# EAGLE schematic flex_led_wrap (EAGLE 6.6.0)
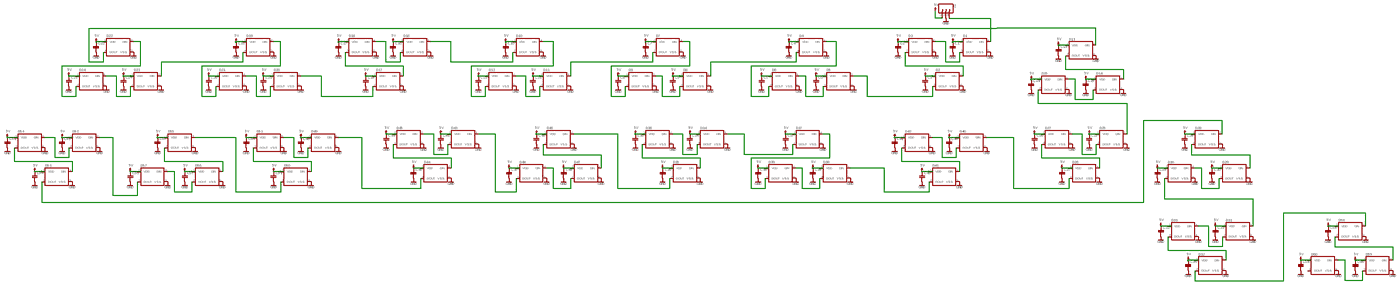
[diagram p0: schematic, sheet 1, overview]
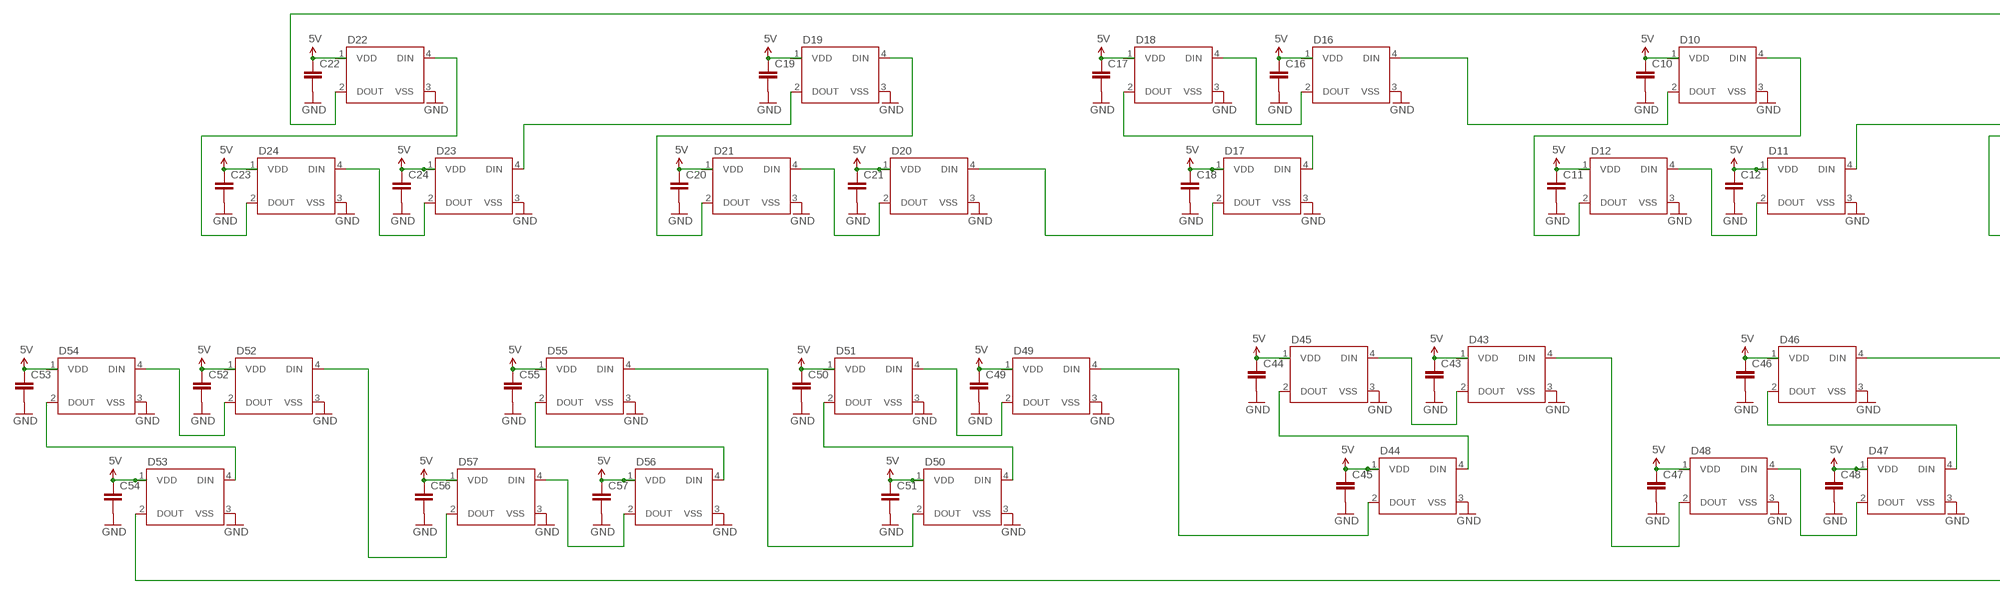
[diagram p1: schematic, sheet 1, part 1 of 4]
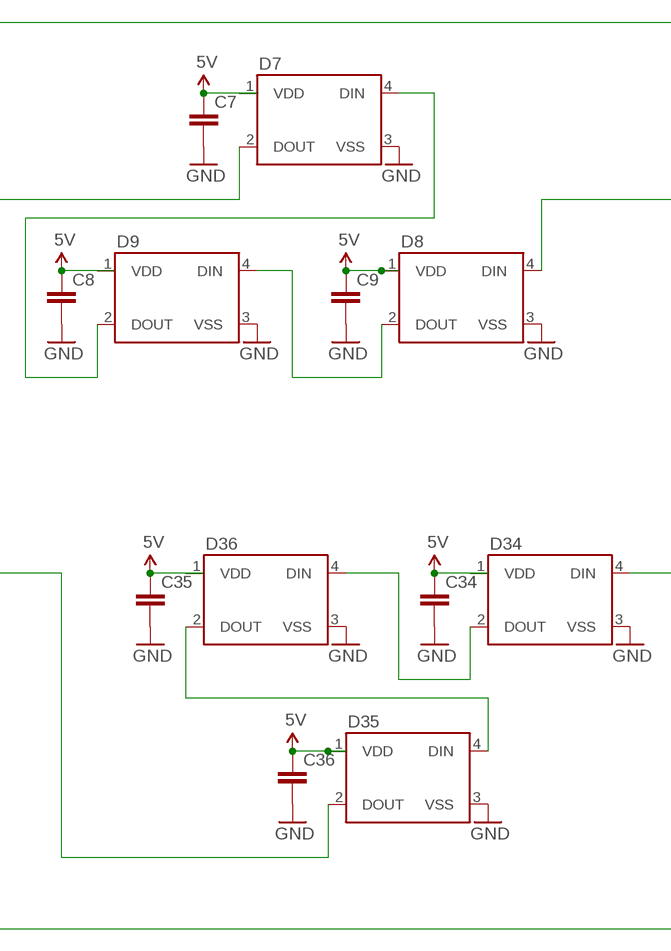
[diagram p2: schematic, sheet 1, part 2 of 4]
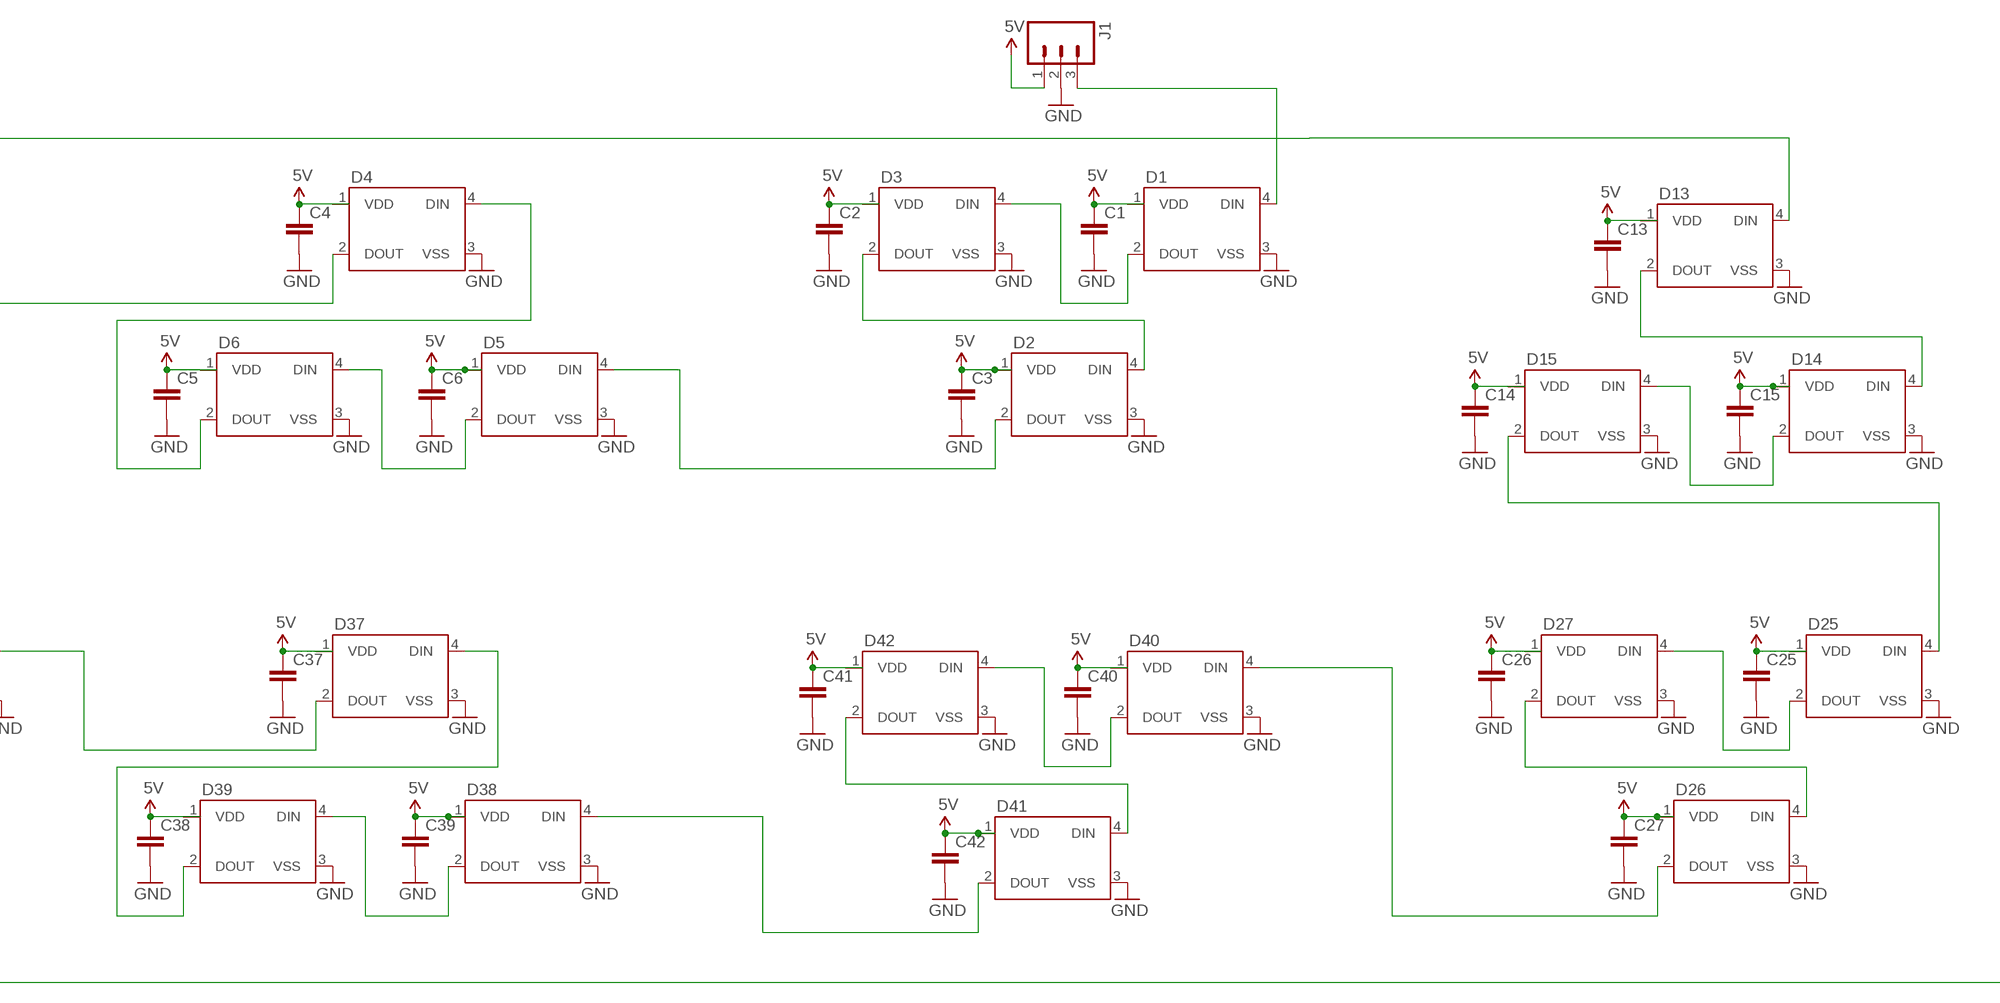
[diagram p3: schematic, sheet 1, part 3 of 4]
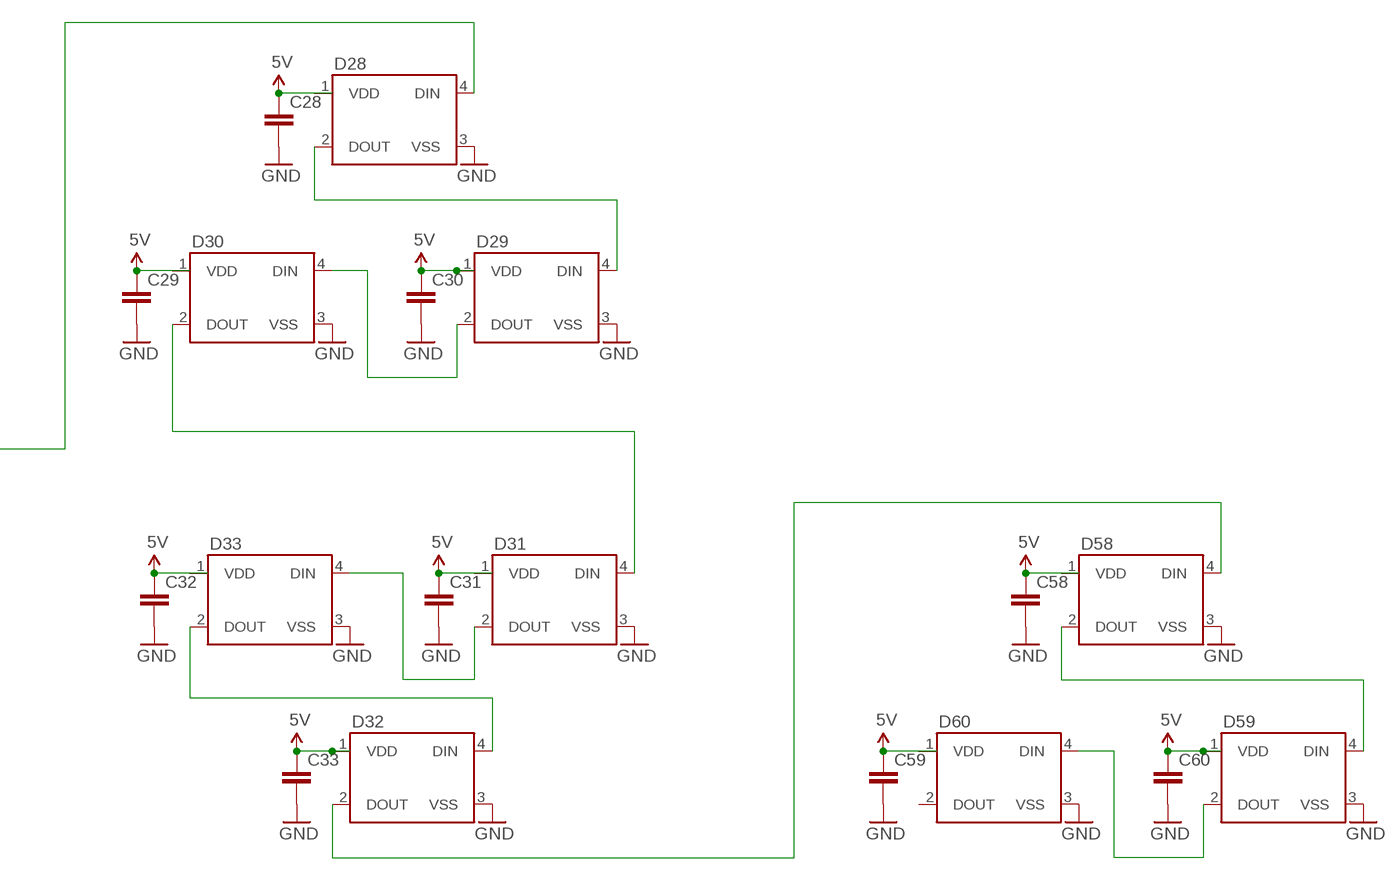
[diagram p4: schematic, sheet 1, part 4 of 4]

## Parts
C1  CAP0805  [0805]
C2  CAP0805  [0805]
C3  CAP0805  [0805]
C4  CAP0805  [0805]
C5  CAP0805  [0805]
C6  CAP0805  [0805]
C7  CAP0805  [0805]
C8  CAP0805  [0805]
C9  CAP0805  [0805]
C10  CAP0805  [0805]
C11  CAP0805  [0805]
C12  CAP0805  [0805]
C13  CAP0805  [0805]
C14  CAP0805  [0805]
C15  CAP0805  [0805]
C16  CAP0805  [0805]
C17  CAP0805  [0805]
C18  CAP0805  [0805]
C19  CAP0805  [0805]
C20  CAP0805  [0805]
C21  CAP0805  [0805]
C22  CAP0805  [0805]
C23  CAP0805  [0805]
C24  CAP0805  [0805]
C25  CAP0805  [0805]
C26  CAP0805  [0805]
C27  CAP0805  [0805]
C28  CAP0805  [0805]
C29  CAP0805  [0805]
C30  CAP0805  [0805]
C31  CAP0805  [0805]
C32  CAP0805  [0805]
C33  CAP0805  [0805]
C34  CAP0805  [0805]
C35  CAP0805  [0805]
C36  CAP0805  [0805]
C37  CAP0805  [0805]
C38  CAP0805  [0805]
C39  CAP0805  [0805]
C40  CAP0805  [0805]
C41  CAP0805  [0805]
C42  CAP0805  [0805]
C43  CAP0805  [0805]
C44  CAP0805  [0805]
C45  CAP0805  [0805]
C46  CAP0805  [0805]
C47  CAP0805  [0805]
C48  CAP0805  [0805]
C49  CAP0805  [0805]
C50  CAP0805  [0805]
C51  CAP0805  [0805]
C52  CAP0805  [0805]
C53  CAP0805  [0805]
C54  CAP0805  [0805]
C55  CAP0805  [0805]
C56  CAP0805  [0805]
C57  CAP0805  [0805]
C58  CAP0805  [0805]
C59  CAP0805  [0805]
C60  CAP0805  [0805]
D1  WS2812B  [WS2812B]
D2  WS2812B  [WS2812B]
D3  WS2812B  [WS2812B]
D4  WS2812B  [WS2812B]
D5  WS2812B  [WS2812B]
D6  WS2812B  [WS2812B]
D7  WS2812B  [WS2812B]
D8  WS2812B  [WS2812B]
D9  WS2812B  [WS2812B]
D10  WS2812B  [WS2812B]
D11  WS2812B  [WS2812B]
D12  WS2812B  [WS2812B]
D13  WS2812B  [WS2812B]
D14  WS2812B  [WS2812B]
D15  WS2812B  [WS2812B]
D16  WS2812B  [WS2812B]
D17  WS2812B  [WS2812B]
D18  WS2812B  [WS2812B]
D19  WS2812B  [WS2812B]
D20  WS2812B  [WS2812B]
D21  WS2812B  [WS2812B]
D22  WS2812B  [WS2812B]
D23  WS2812B  [WS2812B]
D24  WS2812B  [WS2812B]
D25  WS2812B  [WS2812B]
D26  WS2812B  [WS2812B]
D27  WS2812B  [WS2812B]
D28  WS2812B  [WS2812B]
D29  WS2812B  [WS2812B]
D30  WS2812B  [WS2812B]
D31  WS2812B  [WS2812B]
D32  WS2812B  [WS2812B]
D33  WS2812B  [WS2812B]
D34  WS2812B  [WS2812B]
D35  WS2812B  [WS2812B]
D36  WS2812B  [WS2812B]
D37  WS2812B  [WS2812B]
D38  WS2812B  [WS2812B]
D39  WS2812B  [WS2812B]
D40  WS2812B  [WS2812B]
D41  WS2812B  [WS2812B]
D42  WS2812B  [WS2812B]
D43  WS2812B  [WS2812B]
D44  WS2812B  [WS2812B]
D45  WS2812B  [WS2812B]
D46  WS2812B  [WS2812B]
D47  WS2812B  [WS2812B]
D48  WS2812B  [WS2812B]
D49  WS2812B  [WS2812B]
D50  WS2812B  [WS2812B]
D51  WS2812B  [WS2812B]
D52  WS2812B  [WS2812B]
D53  WS2812B  [WS2812B]
D54  WS2812B  [WS2812B]
D55  WS2812B  [WS2812B]
D56  WS2812B  [WS2812B]
D57  WS2812B  [WS2812B]
D58  WS2812B  [WS2812B]
D59  WS2812B  [WS2812B]
D60  WS2812B  [WS2812B]
J1  M03LONGPADS  [1X03_LONGPADS]

## Nets
5V: C1.1 C2.1 C3.1 C4.1 C5.1 C6.1 C7.1 C8.1 C9.1 C10.1 C11.1 C12.1 C13.1 C14.1 C15.1 C16.1 C17.1 C18.1 C19.1 C20.1 C21.1 C22.1 C23.1 C24.1 C25.1 C26.1 C27.1 C28.1 C29.1 C30.1 C31.1 C32.1 C33.1 C34.1 C35.1 C36.1 C37.1 C38.1 C39.1 C40.1 C41.1 C42.1 C43.1 C44.1 C45.1 C46.1 C47.1 C48.1 C49.1 C50.1 C51.1 C52.1 C53.1 C54.1 C55.1 C56.1 C57.1 C58.1 C59.1 C60.1 D1.1(VDD) D2.1(VDD) D3.1(VDD) D4.1(VDD) D5.1(VDD) D6.1(VDD) D7.1(VDD) D8.1(VDD) D9.1(VDD) D10.1(VDD) D11.1(VDD) D12.1(VDD) D13.1(VDD) D14.1(VDD) D15.1(VDD) D16.1(VDD) D17.1(VDD) D18.1(VDD) D19.1(VDD) D20.1(VDD) D21.1(VDD) D22.1(VDD) D23.1(VDD) D24.1(VDD) D25.1(VDD) D26.1(VDD) D27.1(VDD) D28.1(VDD) D29.1(VDD) D30.1(VDD) D31.1(VDD) D32.1(VDD) D33.1(VDD) D34.1(VDD) D35.1(VDD) D36.1(VDD) D37.1(VDD) D38.1(VDD) D39.1(VDD) D40.1(VDD) D41.1(VDD) D42.1(VDD) D43.1(VDD) D44.1(VDD) D45.1(VDD) D46.1(VDD) D47.1(VDD) D48.1(VDD) D49.1(VDD) D50.1(VDD) D51.1(VDD) D52.1(VDD) D53.1(VDD) D54.1(VDD) D55.1(VDD) D56.1(VDD) D57.1(VDD) D58.1(VDD) D59.1(VDD) D60.1(VDD) J1.1
GND: C1.2 C2.2 C3.2 C4.2 C5.2 C6.2 C7.2 C8.2 C9.2 C10.2 C11.2 C12.2 C13.2 C14.2 C15.2 C16.2 C17.2 C18.2 C19.2 C20.2 C21.2 C22.2 C23.2 C24.2 C25.2 C26.2 C27.2 C28.2 C29.2 C30.2 C31.2 C32.2 C33.2 C34.2 C35.2 C36.2 C37.2 C38.2 C39.2 C40.2 C41.2 C42.2 C43.2 C44.2 C45.2 C46.2 C47.2 C48.2 C49.2 C50.2 C51.2 C52.2 C53.2 C54.2 C55.2 C56.2 C57.2 C58.2 C59.2 C60.2 D1.3(VSS) D2.3(VSS) D3.3(VSS) D4.3(VSS) D5.3(VSS) D6.3(VSS) D7.3(VSS) D8.3(VSS) D9.3(VSS) D10.3(VSS) D11.3(VSS) D12.3(VSS) D13.3(VSS) D14.3(VSS) D15.3(VSS) D16.3(VSS) D17.3(VSS) D18.3(VSS) D19.3(VSS) D20.3(VSS) D21.3(VSS) D22.3(VSS) D23.3(VSS) D24.3(VSS) D25.3(VSS) D26.3(VSS) D27.3(VSS) D28.3(VSS) D29.3(VSS) D30.3(VSS) D31.3(VSS) D32.3(VSS) D33.3(VSS) D34.3(VSS) D35.3(VSS) D36.3(VSS) D37.3(VSS) D38.3(VSS) D39.3(VSS) D40.3(VSS) D41.3(VSS) D42.3(VSS) D43.3(VSS) D44.3(VSS) D45.3(VSS) D46.3(VSS) D47.3(VSS) D48.3(VSS) D49.3(VSS) D50.3(VSS) D51.3(VSS) D52.3(VSS) D53.3(VSS) D54.3(VSS) D55.3(VSS) D56.3(VSS) D57.3(VSS) D58.3(VSS) D59.3(VSS) D60.3(VSS) J1.2
N$1: D1.4(DIN) J1.3
N$2: D1.2(DOUT) D3.4(DIN)
N$3: D2.4(DIN) D3.2(DOUT)
N$4: D2.2(DOUT) D5.4(DIN)
N$5: D5.2(DOUT) D6.4(DIN)
N$6: D8.2(DOUT) D9.4(DIN)
N$7: D7.4(DIN) D9.2(DOUT)
N$8: D7.2(DOUT) D11.4(DIN)
N$9: D11.2(DOUT) D12.4(DIN)
N$10: D15.2(DOUT) D25.4(DIN)
N$11: D46.2(DOUT) D47.4(DIN)
N$12: D10.4(DIN) D12.2(DOUT)
N$13: D16.2(DOUT) D18.4(DIN)
N$14: D17.4(DIN) D18.2(DOUT)
N$15: D17.2(DOUT) D20.4(DIN)
N$16: D20.2(DOUT) D21.4(DIN)
N$17: D19.4(DIN) D21.2(DOUT)
N$18: D19.2(DOUT) D23.4(DIN)
N$19: D4.4(DIN) D6.2(DOUT)
N$20: D4.2(DOUT) D8.4(DIN)
N$21: D10.2(DOUT) D16.4(DIN)
N$22: D23.2(DOUT) D24.4(DIN)
N$23: D22.4(DIN) D24.2(DOUT)
N$24: D13.4(DIN) D22.2(DOUT)
N$25: D25.2(DOUT) D27.4(DIN)
N$26: D26.4(DIN) D27.2(DOUT)
N$27: D26.2(DOUT) D40.4(DIN)
N$28: D30.2(DOUT) D31.4(DIN)
N$29: D28.2(DOUT) D29.4(DIN)
N$31: D31.2(DOUT) D33.4(DIN)
N$32: D32.4(DIN) D33.2(DOUT)
N$33: D32.2(DOUT) D58.4(DIN)
N$34: D38.2(DOUT) D39.4(DIN)
N$35: D34.2(DOUT) D36.4(DIN)
N$36: D35.4(DIN) D36.2(DOUT)
N$37: D35.2(DOUT) D46.4(DIN)
N$38: D37.4(DIN) D39.2(DOUT)
N$39: D34.4(DIN) D37.2(DOUT)
N$40: D47.2(DOUT) D48.4(DIN)
N$41: D40.2(DOUT) D42.4(DIN)
N$42: D41.4(DIN) D42.2(DOUT)
N$43: D38.4(DIN) D41.2(DOUT)
N$44: D55.2(DOUT) D56.4(DIN)
N$45: D43.2(DOUT) D45.4(DIN)
N$46: D44.4(DIN) D45.2(DOUT)
N$47: D44.2(DOUT) D49.4(DIN)
N$48: D43.4(DIN) D48.2(DOUT)
N$49: D56.2(DOUT) D57.4(DIN)
N$50: D29.2(DOUT) D30.4(DIN)
N$51: D49.2(DOUT) D51.4(DIN)
N$52: D50.4(DIN) D51.2(DOUT)
N$53: D50.2(DOUT) D55.4(DIN)
N$54: D58.2(DOUT) D59.4(DIN)
N$55: D52.2(DOUT) D54.4(DIN)
N$56: D53.4(DIN) D54.2(DOUT)
N$57: D28.4(DIN) D53.2(DOUT)
N$58: D52.4(DIN) D57.2(DOUT)
N$59: D59.2(DOUT) D60.4(DIN)
N$62: D13.2(DOUT) D14.4(DIN)
N$63: D14.2(DOUT) D15.4(DIN)
Unconnected: D60.2(DOUT)

## Library data of the parts
C1-C60 = SparkFun-Capacitors:CAP: Capacitor Standard 0603 ceramic capacitor, and 0.1" leaded capacitor.
D1-D60 = SparkFun-LED:WS2812B: WS2812B - Intelligent control LED integrated light source Technical Specifications: Power Supply Voltage (VDD): 3.5 to 5.3 V Input Voltage (VI): -0.5 to VDD+0.5 V Operating Junction Temperature (Topt): -25°C to +80°C Storage Temperature Range (Tstg): -55°C to +150°C; PROD_ID: DIO-12503
J1 = SparkFun-Connectors:M03: Header 3 Standard 3-pin 0.1" header. Use with straight break away headers (SKU : PRT-00116), right angle break away headers (PRT-00553), swiss pins (PRT-00743), machine pins (PRT-00117), and female headers (PRT-00115). Molex polarized connector foot print use with SKU : PRT-08232 with associated crimp pins and housings.